# EAGLE design Esquema (EAGLE 8.7.0)
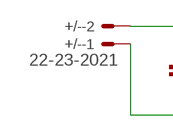
[diagram p0: schematic, sheet 1, part 1 of 2]
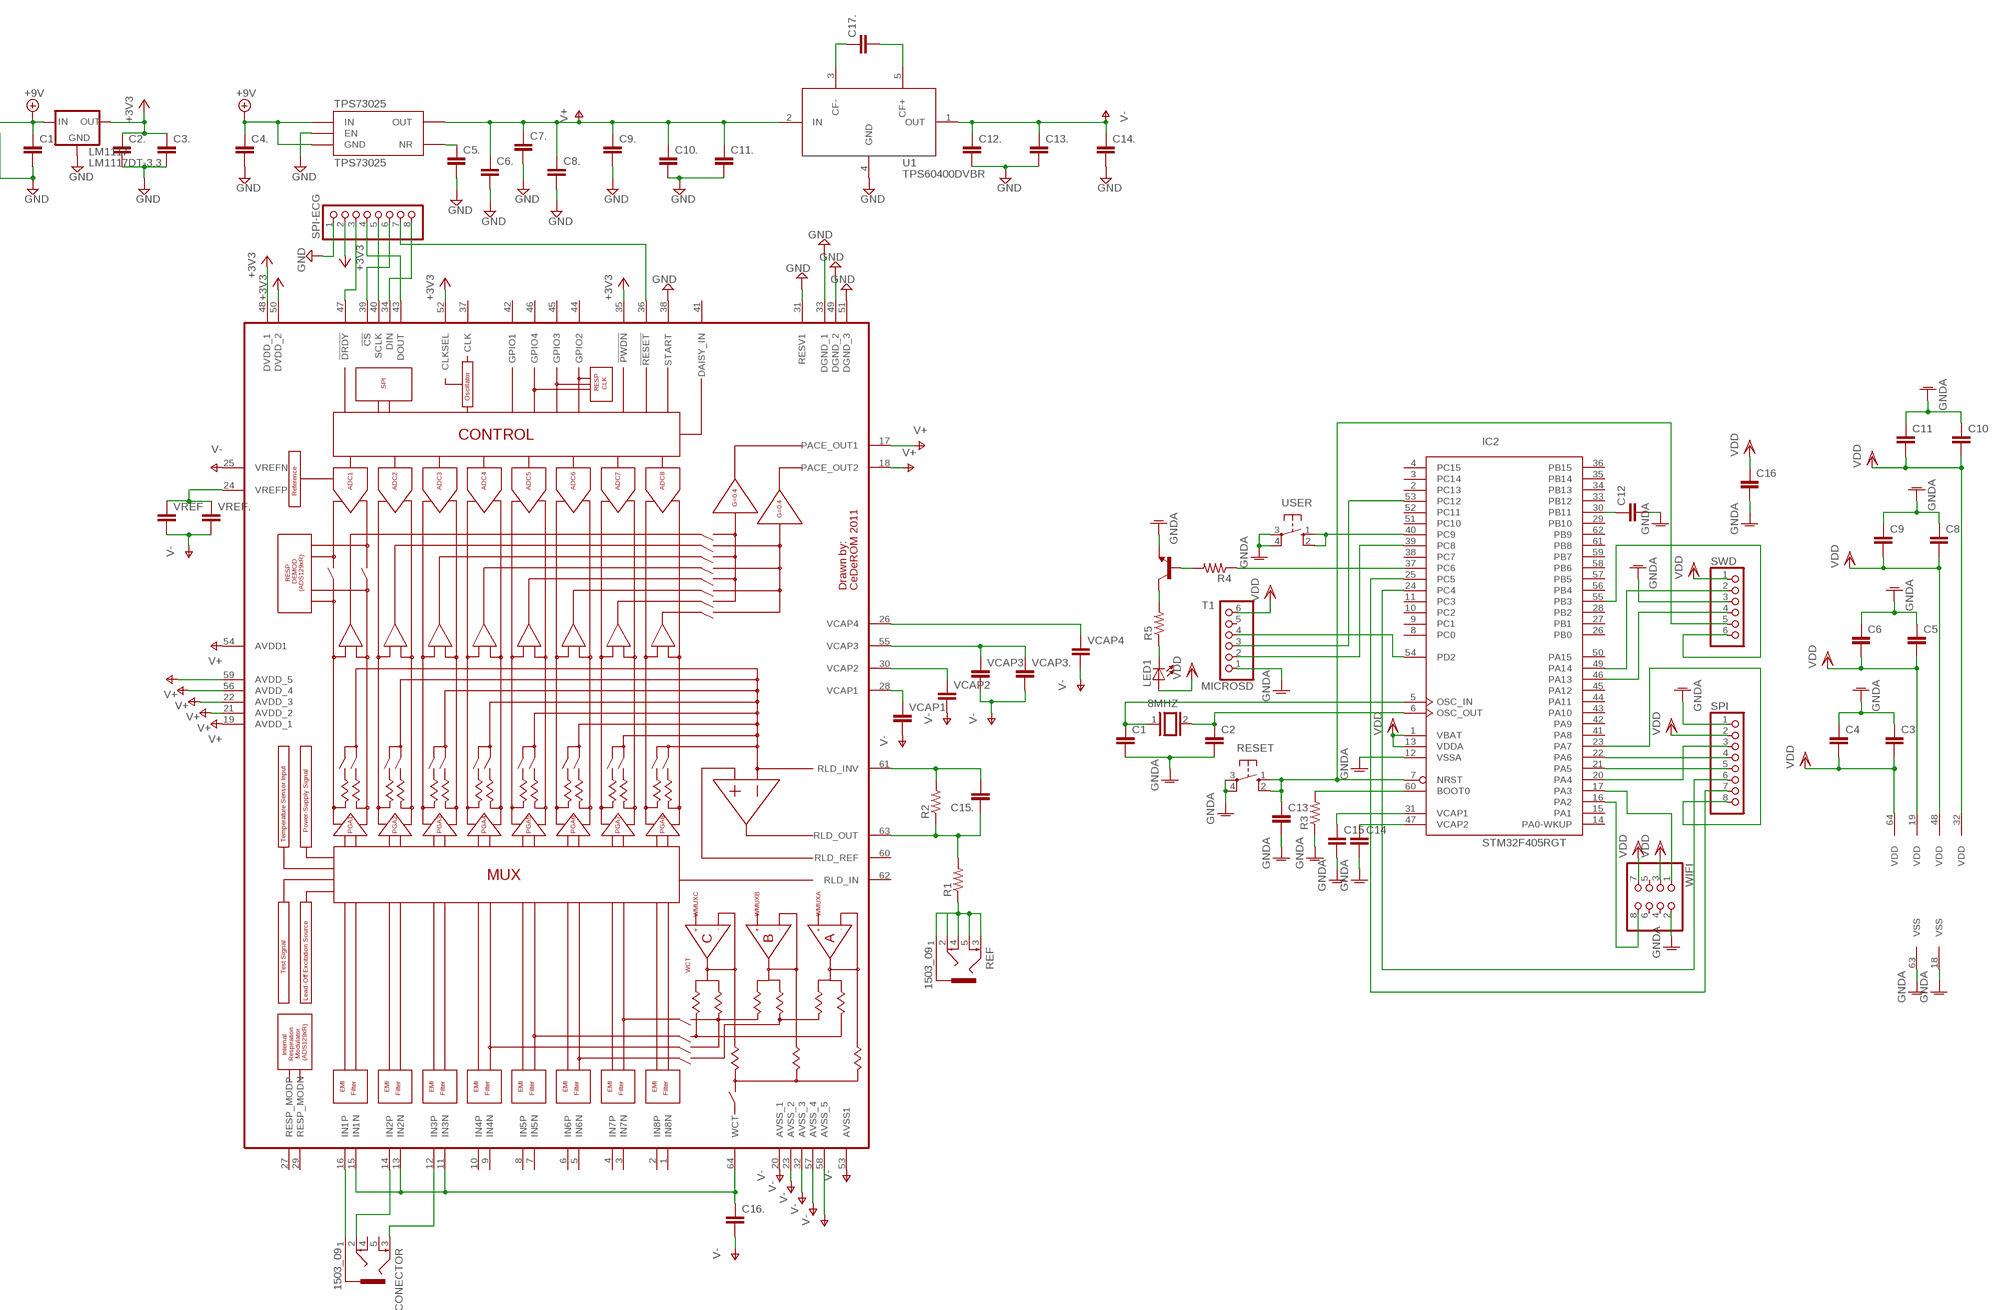
[diagram p1: schematic, sheet 1, part 2 of 2]

## Parts
8MHZ  XTAL/S  [QS]
+/-  22-23-2021  [22-23-2021]
C1  C-EUC0805K  [C0805K]
C1.  C-EUC1206K  [C1206K]
C2  C-EUC0805K  [C0805K]
C2.  C-EUC1206K  [C1206K]
C3  C-EUC1206K  [C1206K]
C3.  C-EUC1206K  [C1206K]
C4  C-EUC1206K  [C1206K]
C4.  C-EUC1206K  [C1206K]
C5  C-EUC1206K  [C1206K]
C5.  C-EUC0805K  [C0805K]
C6  C-EUC1206K  [C1206K]
C6.  C-EUC1206K  [C1206K]
C7.  C-EUC1206K  [C1206K]
C8  C-EUC1206K  [C1206K]
C8.  C-EUC1206K  [C1206K]
C9  C-EUC1206K  [C1206K]
C9.  C-EUC1206K  [C1206K]
C10  C-EUC1206K  [C1206K]
C10.  C-EUC1206K  [C1206K]
C11  C-EUC1206K  [C1206K]
C11.  C-EUC1206K  [C1206K]
C12  C-EUC1206K  [C1206K]
C12.  C-EUC1206K  [C1206K]
C13  C-EUC1206K  [C1206K]
C13.  C-EUC1206K  [C1206K]
C14  C-EUC1206K  [C1206K]
C14.  C-EUC1206K  [C1206K]
C15  C-EUC1206K  [C1206K]
C15.  C-EUC1206K  [C1206K]
C16  C-EUC1206K  [C1206K]
C16.  C-EUC0805K  [C0805K]
C17.  C-EUC1206K  [C1206K]
CONECTOR  1503_09  [1503_09]
IC2  STM32F405RGT  [LQFP64]
LED1  LEDCHIP-LED0805  [CHIP-LED0805]
LM1117  LM1117DT-3.3  [TO252]
MICROSD  PINHD-1X6  [1X06]
R1  R-US_R1206  [R1206]
R2  R-US_R1206  [R1206]
R3  R-US_R1206  [R1206]
R4  R-US_R1206  [R1206]
R5  R-US_R1206  [R1206]
REF  1503_09  [1503_09]
RESET  10-XX  [B3F-10XX]
SPI  PINHD-1X8  [1X08]
SPI-ECG  PINHD-1X8  [1X08]
SWD  PINHD-1X6  [1X06]
T1  MMBT2222ALT1-NPN-SOT23-BEC  [SOT23-BEC]
TPS73025  TPS73025  [SOT23-5L]
U1  TPS60400DVBR  [SOT23-5]
U$1  ADS1298*PAG*  [TQFP64]
USER  10-XX  [B3F-10XX]
VCAP1  C-EUC0805K  [C0805K]
VCAP2  C-EUC1206K  [C1206K]
VCAP3  C-EUC1206K  [C1206K]
VCAP3.  C-EUC1206K  [C1206K]
VCAP4  C-EUC1206K  [C1206K]
VREF  C-EUC1206K  [C1206K]
VREF.  C-EUC1206K  [C1206K]
WIFI  PINHD-2X4  [2X04]

## Nets
+3V3: C2..1 C3..1 LM1117.3(OUT) SPI-ECG.2 U$1.35(!PWDN) U$1.48(DVDD_1) U$1.50(DVDD_2) U$1.52(CLKSEL)
+9V: +/-.2 C1..1 C4..1 LM1117.2(IN) TPS73025.1(IN) TPS73025.2(GND)
GND: +/-.1 C1..2 C2..2 C3..2 C4..2 C5..2 C6..2 C7..2 C8..2 C9..2 C10..2 C11..2 C12..2 C13..2 C14..2 LM1117.1(GND) SPI-ECG.1 TPS73025.3(EN) U1.4(GND) U$1.31(RESV1) U$1.33(DGND_1) U$1.38(START) U$1.49(DGND_2) U$1.51(DGND_3)
GNDA: C1.2 C2.2 C3.1 C4.1 C5.1 C6.1 C8.1 C9.1 C10.1 C11.1 C12.2 C13.2 C14.2 C15.2 C16.2 IC2.12(VSSA) IC2.18(VSS) IC2.63(VSS) MICROSD.1 R3.1 RESET.3(P) RESET.4(P1) SPI.1 SWD.3 T1.E USER.3(P) USER.4(P1) WIFI.2
N$1: C17..1 U1.3(CF-)
N$2: U$1.24(VREFP) VREF.1 VREF..1
N$3: C14.1 IC2.47(VCAP2)
N$4: C17..2 U1.5(CF+)
N$5: U$1.28(VCAP1) VCAP1.1
N$6: C5..1 TPS73025.4(NR)
N$7: U$1.30(VCAP2) VCAP2.1
N$8: U$1.55(VCAP3) VCAP3.1 VCAP3..1
N$9: U$1.26(VCAP4) VCAP4.1
N$10: C16..1 U$1.11(IN3N) U$1.13(IN2N) U$1.15(IN1N) U$1.64(WCT)
N$11: SPI-ECG.7 U$1.36(!RESET)
N$12: SPI-ECG.4 U$1.43(DOUT)
N$13: SPI-ECG.5 U$1.40(SCLK)
N$14: SPI-ECG.6 U$1.39(!CS)
N$15: SPI-ECG.8 U$1.34(DIN)
N$16: SPI-ECG.3 U$1.47(!DRDY)
N$17: C15..1 R1.2 R2.1 U$1.63(RLD_OUT)
N$18: C15..2 R2.2 U$1.61(RLD_INV)
N$19: R1.1 REF.1 REF.2 REF.3 REF.4 REF.5
N$20: CONECTOR.1 U$1.16(IN1P)
N$21: CONECTOR.2 U$1.14(IN2P)
N$22: CONECTOR.3 U$1.12(IN3P)
N$23: 8MHZ.1 C1.1 IC2.5(OSC_IN)
N$24: 8MHZ.2 C2.1 IC2.6(OSC_OUT)
N$25: IC2.60(BOOT0) R3.2
N$26: C12.1 IC2.30(PB11)
N$27: C13.1 IC2.7(NRST) RESET.1(S) RESET.2(S1) SWD.5
N$28: IC2.40(PC9) USER.1(S) USER.2(S1)
N$29: IC2.22(PA6) SPI.4
N$30: IC2.21(PA5) SPI.5
N$31: IC2.24(PC4) SPI.6
N$32: IC2.25(PC5) SPI.7
N$33: IC2.23(PA7) SPI.8
N$34: IC2.20(PA4) SPI.3
N$35: IC2.49(PA14) SWD.2
N$36: IC2.46(PA13) SWD.4
N$37: IC2.55(PB3) SWD.6
N$38: IC2.39(PC8) MICROSD.2
N$39: IC2.53(PC12) MICROSD.3
N$40: IC2.54(PD2) MICROSD.4
N$41: C15.1 IC2.31(VCAP1)
N$42: IC2.16(PA2) WIFI.8
N$43: IC2.17(PA3) WIFI.1
N$44: R4.2 T1.B
N$45: IC2.37(PC6) R4.1
N$46: R5.2 T1.C
N$47: LED1.C R5.1
V+: C6..1 C7..1 C8..1 C9..1 C10..1 C11..1 TPS73025.5(OUT) U1.2(IN) U$1.17(PACE_OUT1) U$1.18(PACE_OUT2) U$1.19(AVDD_1) U$1.21(AVDD_2) U$1.22(AVDD_3) U$1.54(AVDD1) U$1.56(AVDD_4) U$1.59(AVDD_5)
V-: C12..1 C13..1 C14..1 C16..2 U1.1(OUT) U$1.20(AVSS_1) U$1.23(AVSS_2) U$1.25(VREFN) U$1.32(AVSS_3) U$1.53(AVSS1) U$1.57(AVSS_4) U$1.58(AVSS_5) VCAP1.2 VCAP2.2 VCAP3.2 VCAP3..2 VCAP4.2 VREF.2 VREF..2
VDD: C3.2 C4.2 C5.2 C6.2 C8.2 C9.2 C10.2 C11.2 C16.1 IC2.1(VBAT) IC2.13(VDDA) IC2.19(VDD) IC2.32(VDD) IC2.48(VDD) IC2.64(VDD) LED1.A MICROSD.6 SPI.2 SWD.1 WIFI.3 WIFI.7
Unconnected: CONECTOR.4 CONECTOR.5 IC2.2(PC13) IC2.3(PC14) IC2.4(PC15) IC2.8(PC0) IC2.9(PC1) IC2.10(PC2) IC2.11(PC3) IC2.14(PA0-WKUP) IC2.15(PA1) IC2.26(PB0) IC2.27(PB1) IC2.28(PB2) IC2.29(PB10) IC2.33(PB12) IC2.34(PB13) IC2.35(PB14) IC2.36(PB15) IC2.38(PC7) IC2.41(PA8) IC2.42(PA9) IC2.43(PA10) IC2.44(PA11) IC2.45(PA12) IC2.50(PA15) IC2.51(PC10) IC2.52(PC11) IC2.56(PB4) IC2.57(PB5) IC2.58(PB6) IC2.59(PB7) IC2.61(PB8) IC2.62(PB9) MICROSD.5 U$1.1(IN8N) U$1.2(IN8P) U$1.3(IN7N) U$1.4(IN7P) U$1.5(IN6N) U$1.6(IN6P) U$1.7(IN5N) U$1.8(IN5P) U$1.9(IN4N) U$1.10(IN4P) U$1.27(RESP_MODP) U$1.29(RESP_MODN) U$1.37(CLK) U$1.41(DAISY_IN) U$1.42(GPIO1) U$1.44(GPIO2) U$1.45(GPIO3) U$1.46(GPIO4) U$1.60(RLD_REF) U$1.62(RLD_IN) WIFI.4 WIFI.5 WIFI.6

## Library data of the parts
8MHZ = special:XTAL/S: CRYSTAL
+/- = con-molex:22-23-2021: .100" (2.54mm) Center Header - 2 Pin; MF: MOLEX; MPN: 22-23-2021; OC_FARNELL: 1462926; OC_NEWARK: 25C3832
C1-C6 C8-C15 C15. C16 C16. = resistor:C-EU: CAPACITOR, European symbol
C1. C2. C3. C4. C5. C6. C7. C8. C9. C10. C11. C12. C13. C14. C17. VCAP1-VCAP3 VCAP3. VCAP4 VREF VREF. = rcl:C-EU: CAPACITOR, European symbol; SPICEPREFIX: C
CONECTOR REF = con-lumberg:1503_09: Jack connectors according to JISC 6560, 3.5 mm Klinkeneinbaukupplung nach JISC 6560, 3,5 mm, 3-polig/ stereo, abgewinkelte Ausführung, mit 2 Öffnern und Lötaugen, für Leiterplatten Rückseitenmontage Source: http://www.lumberg.com/Produkte/PDFs/1503_09.pdf; OC_FARNELL: 1243244; OC_NEWARK: unknown
IC2 = micro-stm_v2:STM32F405R*T: ARM 32-bit Cortex™-M3 CPU 168 MHz maximum frequency 1024 Kbytes of Flash memory 192 kbytes of SRAM 51 GPIOs 1.8 to 3.6 V application supply
LED1 = led:LED: LED OSRAM: - CHIPLED LG R971, LG N971, LY N971, LG Q971, LY Q971, LO R971, LY R971 LH N974, LH R974 LS Q976, LO Q976, LY Q976 LO Q996 - Hyper CHIPLED LW Q18S LB Q993, LB Q99A, LB R99A - SideLED LS A670, LO A670, LY A670, LG A670, LP A670 LB A673, LV A673, LT A673, LW A673 LH A674 LY A675 LS A676, LA A676, LO A676, LY A676, LW A676 LS A679, LY A679, LG A679 - Hyper Micro SIDELED® LS Y876, LA Y876, LO Y876, LY Y876 LT Y87S - SmartLED LW L88C, LW L88S LB L89C, LB L89S, LG L890 LS L89K, LO L89K, LY L89K LS L896, LA L896, LO L896, LY L896 - TOPLED LS T670, LO T670, LY T670, LG T670, LP T670 LSG T670, LSP T670, LSY T670, LOP T670, LYG T670 LG T671, LOG T671, LSG T671 LB T673, LV T673, LT T673, LW T673 LH T674 LS T676, LA T676, LO T676, LY T676, LB T676, LH T676, LSB T676, LW T676 LB T67C, LV T67C, LT T67C, LS T67K, LO T67K, LY T67K, LW E67C LS E67B, LA E67B, LO E67B, LY E67B, LB E67C, LV E67C, LT E67C LW T67C LS T679, LY T679, LG T679 LS T770, LO T770, LY T770, LG T770, LP T770 LB T773, LV T773, LT T773, LW T773 LH T774 LS E675, LA E675, LY E675, LS T675 LS T776, LA T776, LO T776, LY T776, LB T776 LHGB T686 LT T68C, LB T68C - Hyper Mini TOPLED® LB M676 - Mini TOPLED Santana® LG M470 LS M47K, LO M47K, LY M47K Source: http://www.osram.convergy.de LUXEON: - LUMILED® LXK2-PW12-R00, LXK2-PW12-S00, LXK2-PW14-U00, LXK2-PW14-V00 LXK2-PM12-R00, LXK2-PM12-S00, LXK2-PM14-U00 LXK2-PE12-Q00, LXK2-PE12-R00, LXK2-PE12-S00, LXK2-PE14-T00, LXK2-PE14-U00 LXK2-PB12-K00, LXK2-PB12-L00, LXK2-PB12-M00, LXK2-PB14-N00, LXK2-PB14-P00, LXK2-PB14-Q00 LXK2-PR12-L00, LXK2-PR12-M00, LXK2-PR14-Q00, LXK2-PR14-R00 LXK2-PD12-Q00, LXK2-PD12-R00, LXK2-PD12-S00 LXK2-PH12-R00, LXK2-PH12-S00 LXK2-PL12-P00, LXK2-PL12-Q00, LXK2-PL12-R00 Source: www.luxeon.com KINGBRIGHT: KA-3528ASYC Source: www.kingbright.com
LM1117 = lm1117_10:LM1117?-*: 800mA Low-Dropout Linear Regulator Source: http://www.ti.com/lit/ds/symlink/lm1117-n.pdf; MF: Texas Instruments; MPN: LM1117DT-3.3; OC_FARNELL: 1469048; OC_NEWARK: 41K3430
MICROSD SWD = pinhead:PINHD-1X6: PIN HEADER
R1-R5 = resistor:R-US_: RESISTOR, American symbol
RESET USER = switch-omron:10-XX: OMRON SWITCH; MPN: B3F-1000; OC_FARNELL: 176432; OC_NEWARK: 36M3542
SPI SPI-ECG = pinhead:PINHD-1X8: PIN HEADER
T1 = transistor-neu-to92:*-NPN-: NPN Transistror
TPS73025 = texas-instruments:TPS73025
U1 = TPS6040x:TPS6040*: Texas Instruments TPS4060x • Inverts Input Supply Voltage • Up to 60-mA Output Current • Only Three Small 1-μF Ceramic Capacitors Needed • Input Voltage Range From 1.6 V to 5.5 V • PowerSave-Mode for Improved Efficiency at Low- Output Currents (TPS60400) • Device Quiescent Current Typical 65 μA • Integrated Active Schottky-Diode for Start-up Into Load • Small 5-Pin SOT-23 Package • Evaluation Module Available TPS60400EVM-178 Datasheet <http://www.ti.com/lit/ds/symlink/tps60400.pdf>; DIST: FARNELL; MOQ: 3000; SMD_MARKING: PFKI
U$1 = ADS1298:ADS1298: 8-Channel, 24-Bit Analog-To-Digital Converter With Integrated ECG Front End. Warning: PAG variant (TQFP package) does not have Respiration Module - pins 27 and 29 must stay unconnected! Drawn 23.07.2011 by Tomasz Boleslaw CEDRO (http://www.tomek.cedro.info).
WIFI = pinhead:PINHD-2X4: PIN HEADER

## Board
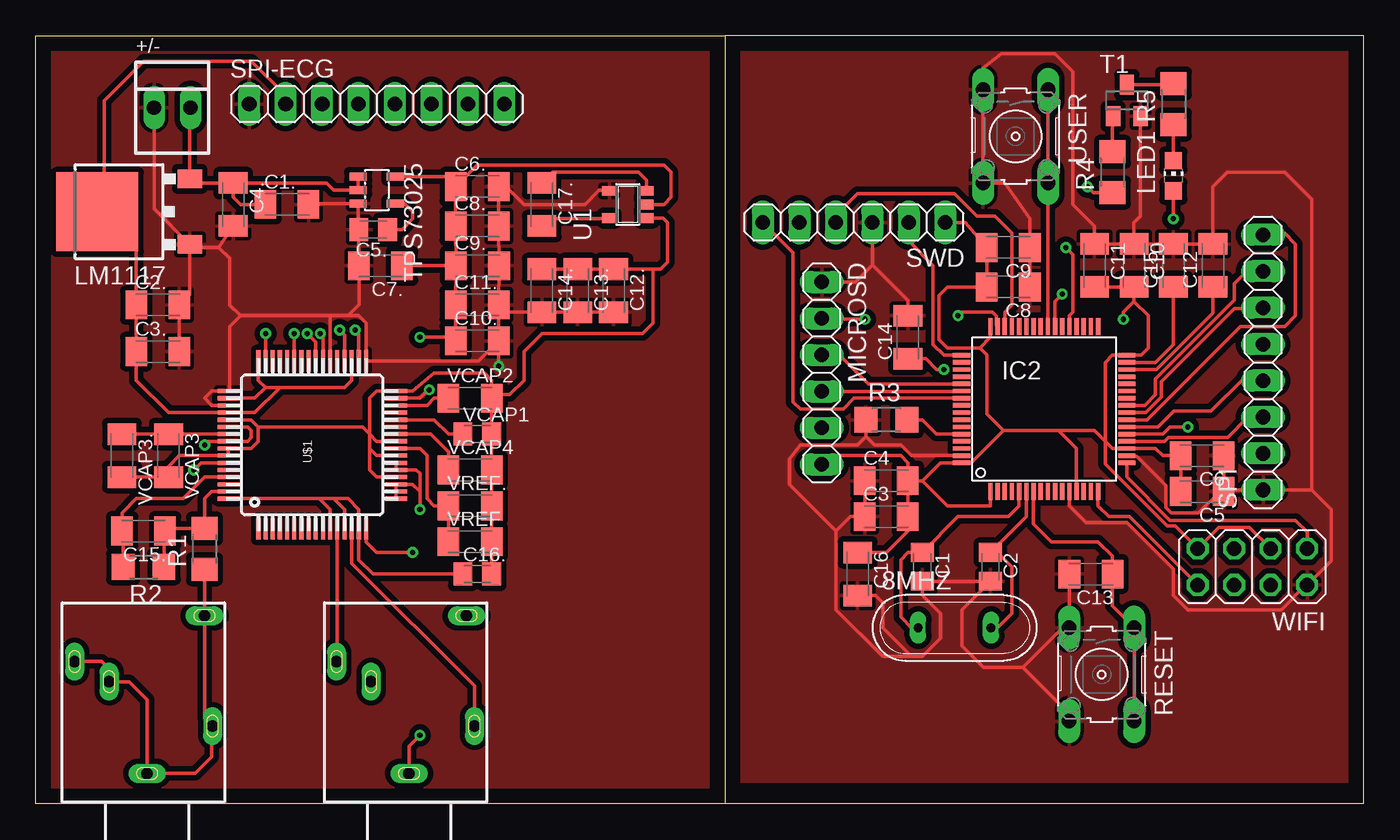
[diagram p2: board, top side]
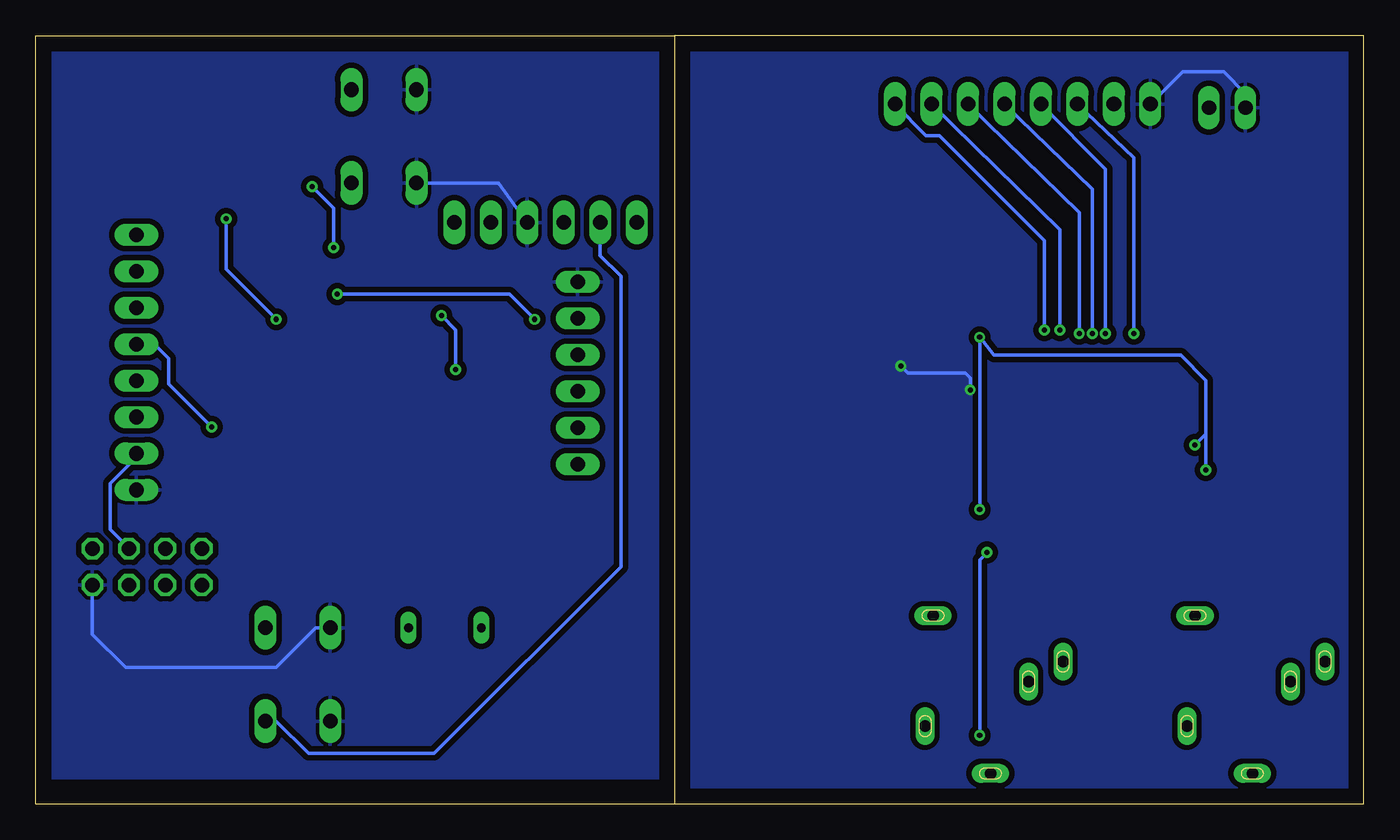
[diagram p3: board, bottom side, seen from below]

Size 92.5 x 53.5 mm. Coordinates in mm from the lower left corner, seen from the top.
Outline: 48,53.5 48,0
Outline: 48,53.5 92.5,53.5 92.5,0 48,0
Outline: 48,0 0,0 0,53.5 48,53.5
Copper layers (1*16): Top 0.035mm / dielectric 1.5mm / Bottom 0.035mm
Design rules "default *": minimum track width 6mil, minimum drill 0.35mm, track to track 6mil, track to pad 6mil, pad to pad 6mil, via to via 6mil, smd to smd 6mil, copper to edge 40mil, drill to drill 6mil, minimum pad ring 10mil, minimum via ring 8mil, stop-mask expansion 4mil, vias tented up to drill 0mil, thermal gap 10mil

### Footprints (pad centres in the part's own frame; a part is rotated, then mirrored left to right if it is on the bottom)
QS = drill 0.61 long: 1 -2.54,0; 2 2.54,0
22-23-2021 = drill 1 long: 1 -1.27,0; 2 1.27,0
C0805K = smd 1.3 x 1.6: 1 -1,0; 2 1,0
C1206K = smd 1.5 x 2: 1 -1.5,0; 2 1.5,0
1503_09 = drill 0.8 pad 1.2 long: 1 0,-2.1; 2 -4.55,-5.4; 3 5.05,-9.9; 4 -4,-13.1; 5 2.65,-8.5
LQFP64 = smd 0.3 x 1.2: 1 -3.75,-5.75; 2 -3.25,-5.75; 3 -2.75,-5.75; 4 -2.25,-5.75; 5 -1.75,-5.75; 6 -1.25,-5.75; 7 -0.75,-5.75; 8 -0.25,-5.75; 9 0.25,-5.75; 10 0.75,-5.75; 11 1.25,-5.75; 12 1.75,-5.75; 13 2.25,-5.75; 14 2.75,-5.75; 15 3.25,-5.75; 16 3.75,-5.75; 33 3.75,5.75; 34 3.25,5.75; 35 2.75,5.75; 36 2.25,5.75; 37 1.75,5.75; 38 1.25,5.75; 39 0.75,5.75; 40 0.25,5.75; 41 -0.25,5.75; 42 -0.75,5.75; 43 -1.25,5.75; 44 -1.75,5.75; 45 -2.25,5.75; 46 -2.75,5.75; 47 -3.25,5.75; 48 -3.75,5.75 | smd 1.2 x 0.3: 17 5.75,-3.75; 18 5.75,-3.25; 19 5.75,-2.75; 20 5.75,-2.25; 21 5.75,-1.75; 22 5.75,-1.25; 23 5.75,-0.75; 24 5.75,-0.25; 25 5.75,0.25; 26 5.75,0.75; 27 5.75,1.25; 28 5.75,1.75; 29 5.75,2.25; 30 5.75,2.75; 31 5.75,3.25; 32 5.75,3.75; 49 -5.75,3.75; 50 -5.75,3.25; 51 -5.75,2.75; 52 -5.75,2.25; 53 -5.75,1.75; 54 -5.75,1.25; 55 -5.75,0.75; 56 -5.75,0.25; 57 -5.75,-0.25; 58 -5.75,-0.75; 59 -5.75,-1.25; 60 -5.75,-1.75; 61 -5.75,-2.25; 62 -5.75,-2.75; 63 -5.75,-3.25; 64 -5.75,-3.75
CHIP-LED0805 = smd 1.2 x 1.2: A 0,-1.05; C 0,1.05
TO252 = smd 1.3 x 1.7: 1 -2.285,-4.22; 2 2.285,-4.22 | smd 5.5 x 5.7: 3 0,2.22
1X06 = drill 1.016 long: 1 -6.35,0; 2 -3.81,0; 3 -1.27,0; 4 1.27,0; 5 3.81,0; 6 6.35,0
R1206 = smd 1.6 x 1.803: 1 -1.422,0; 2 1.422,0
B3F-10XX = drill 1.016 long: 1 -3.251,2.261; 2 3.251,2.261; 3 -3.251,-2.261; 4 3.251,-2.261
1X08 = drill 1.016 long: 1 -8.89,0; 2 -6.35,0; 3 -3.81,0; 4 -1.27,0; 5 1.27,0; 6 3.81,0; 7 6.35,0; 8 8.89,0
SOT23-BEC = smd 1 x 1.4: B -0.95,-1.1; C 0,1.1; E 0.95,-1.1
SOT23-5L = smd 0.55 x 1.2: 1 -0.95,-1.3; 2 0,-1.3; 3 0.95,-1.3; 4 0.95,1.3; 5 -0.95,1.3
SOT23-5 = smd 0.69 x 0.99: 1 -0.95,-1.29; 2 0,-1.29; 3 0.95,-1.29; 4 0.95,1.3; 5 -0.95,1.3
TQFP64 = smd 1.5 x 0.285: 1 -5.85,3.75; 2 -5.85,3.25; 3 -5.85,2.75; 4 -5.85,2.25; 5 -5.85,1.75; 6 -5.85,1.25; 7 -5.85,0.75; 8 -5.85,0.25; 9 -5.85,-0.25; 10 -5.85,-0.75; 11 -5.85,-1.25; 12 -5.85,-1.75; 13 -5.85,-2.25; 14 -5.85,-2.75; 15 -5.85,-3.25; 16 -5.85,-3.75; 33 5.85,-3.75; 34 5.85,-3.25; 35 5.85,-2.75; 36 5.85,-2.25; 37 5.85,-1.75; 38 5.85,-1.25; 39 5.85,-0.75; 40 5.85,-0.25; 41 5.85,0.25; 42 5.85,0.75; 43 5.85,1.25; 44 5.85,1.75; 45 5.85,2.25; 46 5.85,2.75; 47 5.85,3.25; 48 5.85,3.75 | smd 0.285 x 1.5: 17 -3.75,-5.85; 18 -3.25,-5.85; 19 -2.75,-5.85; 20 -2.25,-5.85; 21 -1.75,-5.85; 22 -1.25,-5.85; 23 -0.75,-5.85; 24 -0.25,-5.85; 25 0.25,-5.85; 26 0.75,-5.85; 27 1.25,-5.85; 28 1.75,-5.85; 29 2.25,-5.85; 30 2.75,-5.85; 31 3.25,-5.85; 32 3.75,-5.85; 49 3.75,5.85; 50 3.25,5.85; 51 2.75,5.85; 52 2.25,5.85; 53 1.75,5.85; 54 1.25,5.85; 55 0.75,5.85; 56 0.25,5.85; 57 -0.25,5.85; 58 -0.75,5.85; 59 -1.25,5.85; 60 -1.75,5.85; 61 -2.25,5.85; 62 -2.75,5.85; 63 -3.25,5.85; 64 -3.75,5.85
2X04 = drill 1.016 octagon: 1 -3.81,-1.27; 2 -3.81,1.27; 3 -1.27,-1.27; 4 -1.27,1.27; 5 1.27,-1.27; 6 1.27,1.27; 7 3.81,-1.27; 8 3.81,1.27

### Placement (x,y rotation side)
8MHZ  64,12.25 0 top
+/-  9.5,48.5 0 top
C1  61.75,16.5 270 top
C1.  17.5,41.75 0 top
C2  66.5,16.5 270 top
C2.  8.5,34.75 0 top
C3  59.25,20 0 top
C3.  8.5,31.5 0 top
C4  59.25,22.5 0 top
C4.  13.75,41.75 270 top
C5  81.25,21.75 180 top
C5.  23.5,40 180 top
C6  81.25,24.25 180 top
C6.  30.75,43 0 top
C7.  24.01,37.48 180 top
C8  67.75,36 180 top
C8.  30.75,40.25 0 top
C9  67.75,38.75 180 top
C9.  30.77,37.48 0 top
C10  76.5,37.5 270 top
C10.  30.75,32.25 0 top
C11  73.75,37.5 270 top
C11.  30.75,34.75 0 top
C12  82,37.5 90 top
C12.  40.25,35.75 270 top
C13  73.5,16 180 top
C13.  37.75,35.75 270 top
C14  60.75,32.5 90 top
C14.  35.25,35.75 270 top
C15  79.25,37.5 90 top
C15.  7.5,19 180 top
C16  57.25,16 270 top
C16.  30.75,16 0 top
C17.  35.25,41.75 270 top
CONECTOR  26,0 180 top
IC2  70.25,27.5 0 top
LED1  79.25,43.75 0 top
LM1117  6.5,41.25 90 top
MICROSD  54.75,30 270 top
R1  11.75,17.75 90 top
R2  7.5,16.5 180 top
R3  59.25,26.75 0 top
R4  75,44 90 top
R5  79.25,48.75 90 top
REF  7.75,0 180 top
RESET  74.25,9 270 top
SPI  85.5,30.75 90 top
SPI-ECG  23.75,48.75 0 top
SWD  57,40.5 180 top
T1  76,49 0 top
TPS73025  23.75,42.75 270 top
U1  41.25,41.75 90 top
U$1  19.25,25 90 top
USER  68.25,46.5 270 top
VCAP1  30.75,25.75 0 top
VCAP2  30.25,28.25 0 top
VCAP3  9.25,24.25 270 top
VCAP3.  6,24.25 270 top
VCAP4  30.25,23.25 0 top
VREF  30.25,18.25 0 top
VREF.  30.25,20.75 0 top
WIFI  84.75,16.5 180 top

### Tracks (layer width: path | path; a pad name or v marks a point on that pad's centre or on a via)
+3V3
  Top 0.152: LM1117.3 4.51,41.02 7,38.53
  Top 0.254: 7,38.53 C2..1 C3..1 7,29.5 9.25,27.25 U$1.52 15.25,27.25 17,29 | U$1.35 22,29.5 21.5,29 17,29 | 17,29 16,29 | 16,29 15.5,29.5 U$1.48 | U$1.50 15.25,28.25 16,29 | SPI-ECG.2 17.4,49.35 15,51.75 7.5,51.75 4.75,49 4.75,41.25 4.51,41.02
+9V
  Top 0.254: C4..1 20.25,43.25 20.75,42.75 TPS73025.2 TPS73025.1 | C4..1 11.01,43.25 LM1117.2 10.72,48.45 +/-.2 | C4..1 13.75,42.25 14.25,41.75 C1..1
GND  (via drill 0.35)
  Top 0.152: 22.45,39.8 C5..2 | C11..2 32.25,34.5 32.5,34.25
  Top 0.254: C4..2 12.75,38.75 | 12.75,38.75 10.94,38.75 LM1117.1 | +/-.1 8.23,41.45 LM1117.1 | U$1.51 12.25,27.75 11.75,28.25 12.25,28.75 U$1.49 13.5,28.85 13.5,33.25 14.25,34 | TPS73025.3 22.5,41.75 | C12..2 C13..2 C14..2 32.75,34.25 C11..2 | C11..2 C10..2 | C11..2 C9..2 C8..2 C6..2 32.75,43 34,41.75 38.25,41.75 39.25,42.75 39.9,42.75 U1.4 | TPS73025.3 22.45,40.05 C5..2 C7..2 22.51,34.76 21.75,34 | C10..2 30.85,30.85 U$1.33 23,33.5 22.5,34 22,34 | 20.5,34 20.47,33.97 | U$1.38 20.5,34 | 20.5,34 21.75,34 | 21.75,34 22,34 | 22.01,34.01 22,34 | 20.5,34 14.25,34 | TPS73025.3 19.05,41.8 C1..2 | 12.75,38.75 13.5,38 13.5,34.75 14.25,34 | U$1.31 26.75,28.25 27.34,28.84 v27.41,28.84 | v32.25,30.5 C10..2 | C3..2 C2..2 10.72,35.47 LM1117.1
  Bottom 0.254: SPI-ECG.1 12.61,51 9.75,51 8.23,49.48 +/-.1 | v27.41,28.84 27.41,29.66 27.75,30 31.75,30 v32.25,30.5
  pour Top (isolate 0.381): 0.25,53.25 47.75,53.25 47.75,0.25 0.25,0.25
  pour Bottom (isolate 0.381): 0.5,53 47.25,53 47.5,0.5 0.5,0.5
GNDA
  Top 0.254: C4.1 C3.1 56.75,20 55.75,19 | C5.1 C6.1 | C8.1 C9.1 69.25,40.75 67.5,43.25 USER.4 | C10.1 C11.1 73.75,40.25 72.25,41.75 72.25,51 71,52.25 67.25,52.25 65.99,51.24 USER.3 USER.4 | 88.89,21.86 SPI.1 82.86,21.86 C5.1 | 88.89,21.86 90.25,20.5 90.25,16.92 WIFI.2 88.48,15.23 86.75,13.5 80.25,13.5 79.25,14.5 79.25,16.34 76,19.59 73.16,19.59 72,20.75 IC2.12 | MICROSD.1 57.1,36.35 58.27,37.52 | 58.27,37.52 SWD.3 | USER.4 | 68.75,9.5 66,9.5 64.5,11 64.5,13.5 C2.2 C1.2 61.75,14.5 63,13.25 63,11.5 61.75,10.25 61,10.25 | 68.75,9.5 71.5,12.25 RESET.3 72,12.26 C13.2 | 61,10.25 59,10.25 55.75,13.5 55.75,19 | RESET.4 71.99,6.26 68.75,9.5 | 88.89,21.86 88.89,42.11 87,44 83,44 82,43 C12.2 C15.2 C10.1 | IC2.18 76.07,24.18 76.72,24.18 78.72,22.17 78.72,20.63 79.11,20.25 81,20.25 82.5,21.75 C5.1 | 55.75,19 52.5,22.25 52.5,24 53.25,25 57.25,25 57.83,25.58 | IC2.63 61,24.25 60.25,25 58.41,25 57.83,25.58 | 58.27,37.52 60.75,35.04 C14.2 | T1.E 76.95,40.95 76.5,40.5 C10.1 | 61,10.25 59,12.25 59,14 58.5,14.5 C16.2 | R3.1 57.83,25.58
  Bottom 0.254: USER.4 60.27,43.25 SWD.3 | RESET.3 73,12.25 75.75,9.5 86.25,9.5 88.56,11.81 WIFI.2
  pour Top (isolate 0.381): 48.25,53.25 92.25,53.25 92.25,1.5 48.25,1.5 48.25,4.25
  pour Bottom (isolate 0.381): 48.5,53 92,53 92,52.75 92,1.75 91.5,1.75 48.5,1.75 48.5,4.75
N$1
  Top 0.254: U1.3 42.54,43.46 42,44 36,44 C17..1
N$2
  Top 0.254: VREF.1 VREF..1 27.75,20.75 27.25,21.25 27.25,24.25 26.75,24.75 U$1.24
N$3  (via drill 0.35)
  Top 0.254: IC2.47 66.93,33.32 66.93,33.97 66.64,34.25 64.5,34.25 v64.25,34 | v63.25,30.25 62.75,30.25 62,31 C14.1
  Bottom 0.254: v64.25,34 63.25,33 v63.25,30.25
N$4
  Top 0.254: U1.5 39.9,40.75 35.75,40.75 C17..2
N$5
  Top 0.254: VCAP1.1 28.75,25.75 27.75,26.75 U$1.28
N$6
  Top 0.254: C5..1 25.5,40 26.25,40.75 26.25,41.25 25.7,41.8 TPS73025.4
N$7
  Top 0.254: VCAP2.1 27.75,28.25 27.25,27.75 U$1.30
N$8
  Top 0.254: U$1.55 VCAP3.1 VCAP3..1
N$9
  Top 0.254: VCAP4.1 28.75,24.5 27.5,25.75 U$1.26
N$10
  Top 0.254: C16..1 23.5,16 22.5,17 U$1.15 22.5,20.5 21.75,21.25 20.75,21.25 | U$1.64 19.75,21.25 | 19.75,21.25 20.75,21.25 | 19.75,21.25 20.5,20.5 U$1.11 | 20.75,21.25 21.5,20.5 U$1.13
N$11  (via drill 0.35)
  Top 0.254: v21.16,33 21.5,32.66 U$1.36
  Bottom 0.254: v21.16,33 21.16,40 SPI-ECG.7
N$12  (via drill 0.35)
  Top 0.254: U$1.43 v18,32.75
  Bottom 0.254: SPI-ECG.4 18,44.21 v18,32.75
N$13  (via drill 0.35)
  Top 0.152: U$1.40 19.5,32.16 19.45,32.2
  Top 0.254: v18.91,32.75 19.16,32.5 19.16,32.48 19.49,32.15 U$1.40
  Bottom 0.254: v18.91,32.75 18.91,42.83 SPI-ECG.5
N$14  (via drill 0.35)
  Top 0.254: U$1.39 20,32.5 19.82,32.68 v19.82,32.75
  Bottom 0.254: v19.82,32.75 19.82,41.2 SPI-ECG.6
N$15  (via drill 0.35)
  Top 0.254: U$1.34 22.5,32.75 v22.25,33
  Bottom 0.254: v22.25,33 22.25,39.25 29.55,46.55 30.5,46.55 SPI-ECG.8
N$16  (via drill 0.35)
  Top 0.254: U$1.47 v16,32.75
  Bottom 0.254: v16,32.75 16,45 SPI-ECG.3
N$17
  Top 0.152: 8.92,18.92 C15..1 9.17,19.17
  Top 0.254: R2.1 8.92,18.92 | 9.17,19.17 R1.2 11.75,21.25 12.25,21.75 U$1.63
N$18
  Top 0.152: 6.08,18.92 C15..2
  Top 0.254: R2.2 6.08,18.92 | U$1.61 11.75,22.75 10.25,21.25 7,21.25 6,20.25 C15..2
N$19
  Top 0.254: R1.1 REF.4 11.75,5.95 REF.2 12.25,5.35 12.25,3.25 11.1,2.1 REF.1 7.75,7.25 6.5,8.5 REF.5 5.1,9.4 4.6,9.9 REF.3
N$20  (via drill 0.35)
  Top 0.254: CONECTOR.1 26,4 v26.75,4.75 | v26.25,17.5 23.75,17.5 23,18.25 U$1.16
  Bottom 0.254: v26.75,4.75 26.75,17 v26.25,17.5
N$21
  Top 0.254: U$1.14 22,16.75 30.55,8.2 CONECTOR.2
N$22
  Top 0.254: U$1.12 21,9.95 CONECTOR.3
N$23
  Top 0.254: IC2.5 68.5,20.75 67.75,20 64.25,20 C1.1 60.75,17.5 60.25,17 60.25,13 61,12.25 8MHZ.1
N$24
  Top 0.254: IC2.6 69,20 C2.1 67,17.5 68,16.5 68,13.25 67,12.25 8MHZ.2
N$25
  Top 0.254: R3.2 61.75,26.75 62.75,25.75 IC2.60
N$26
  Top 0.254: IC2.30 78.08,30.25 82,34.17 C12.1
N$27
  Top 0.254: 76.5,12.26 RESET.1 | RESET.1 RESET.2 | RESET.1 75,13.76 C13.1 75,17.25 74,18.25 70.75,18.25 69.5,19.5 IC2.7
  Bottom 0.254: RESET.2 75.75,5.75 73.5,3.5 64.75,3.5 51.75,16.5 51.75,36.75 53.19,38.19 SWD.5
N$28
  Top 0.254: USER.1 USER.2 70.51,33.26 IC2.40 70.53,33.28
N$29
  Top 0.254: IC2.22 78.17,26.25 79.27,27.35 81.85,27.35 84,29.5 85.48,29.5 SPI.4
N$30  (via drill 0.35)
  Top 0.254: IC2.21 78.5,25.75 79,26.25 v80.25,26.25
  Bottom 0.254: v80.25,26.25 83.25,29.25 83.25,31 84.27,32.02 SPI.5
N$31
  Top 0.254: SPI.6 85.44,34.5 83.5,34.5 78.41,29.41 78.41,28.33 77.33,27.25 IC2.24
N$32
  Top 0.254: IC2.25 77.25,27.75 78,28.5 78,29.6 83.5,35.1 83.5,36.25 84.35,37.1 SPI.7
N$33
  Top 0.254: SPI.8 86.89,39.64 87,39.75 87.75,39 87.75,34 87,33.25 83.9,33.25 77.4,26.75 IC2.23
N$34
  Top 0.254: IC2.20 78.61,25.25 78.88,25.53 83.03,25.53 84.44,26.94 SPI.3
N$35
  Top 0.254: IC2.49 63.25,31.25 62.5,32 62.5,37.5 60.81,39.19 SWD.2
N$36
  Top 0.254: IC2.46 67.5,34.25 68,34.75 68,39.75 66.81,40.94 65.56,40.94 64,42.5 57.25,42.5 55.73,40.98 SWD.4
N$37
  Top 0.254: SWD.6 52.75,38.4 52.75,28 53.25,27.5 56.25,27.5 57,28.25 IC2.55
N$38  (via drill 0.35)
  Top 0.254: IC2.39 71,35 v71.5,35.5 | v57.75,33.75 54.81,33.75 MICROSD.2
  Bottom 0.254: v71.5,35.5 59.5,35.5 v57.75,33.75
N$39
  Top 0.254: MICROSD.3 55.98,31.27 58,29.25 IC2.53
N$40
  Top 0.254: MICROSD.4 64.48,28.73 IC2.54
N$41
  Top 0.254: IC2.31 78,30.75 79.25,32 C15.1
N$42
  Top 0.254: WIFI.8 76.17,20 74.75,20 74,20.75 IC2.16
N$43
  Top 0.254: WIFI.1 88.56,18.94 87.75,19.75 79,19.75 76,22.75 IC2.17
N$44
  Top 0.254: R4.2 75,47.85 T1.B
N$45  (via drill 0.35)
  Top 0.254: R4.1 73.67,42.58 v73.25,43 | v71.75,38.75 72.25,38.25 72.25,34.25 72,34 IC2.37
  Bottom 0.254: v73.25,43 71.75,41.5 v71.75,38.75
N$46
  Top 0.254: T1.C 79.18,50.1 R5.2
N$47
  Top 0.254: R5.1 LED1.C
V+  (via drill 0.35)
  Top 0.254: U$1.22 U$1.21 26.5,23.25 26.75,23 26.75,21.75 | TPS73025.5 28.55,43.7 C6..1 | U1.2 43.75,41.75 44.25,42.25 44.25,44 43.75,44.5 30.75,44.5 C6..1 | C9..1 C11..1 C10..1 29,32.5 v26.75,32.5 | C9..1 C8..1 C6..1 | C7..1 C9..1 | U$1.54 14.75,26.25 15,26 15,25.5 14.75,25.25 U$1.56 12,25.25 v11.75,25 | 26.75,21.75 v26.75,20.5 | 26.75,21.75 26.25,22.25 U$1.19 U$1.18 U$1.17 | U$1.59 11.5,23.75 v11,23.25
  Bottom 0.254: v26.75,20.5 v26.75,32.5 25.75,31.25 12.75,31.25 11,29.5 11,25.75 | v11,23.25 11,25.75 | v11.75,25 11,25.75
V-
  Top 0.254: VCAP3..2 VCAP3.2 9.25,23.5 10,24.25 U$1.58 U$1.57 15,24.75 15.5,25.25 15.5,26.25 | U1.1 43.7,40.8 44,40.5 44,37.75 43.5,37.25 43,37.25 | 43,37.25 C12..1 C13..1 C14..1 | 43,37.25 43,33.5 42.25,32.75 35.25,32.75 34,31.5 34,29.5 33,28.5 32,28.5 VCAP2.2 | 31.75,28.75 VCAP2.2 | VCAP2.2 VCAP1.2 VCAP4.2 VREF..2 VREF.2 C16..2 | U$1.53 15,26.75 15.5,26.25 | VCAP2.2 31.75,29.5 31.25,30 27.75,30 26.25,28.75 U$1.32 23.75,28.75 23.25,28.25 23.25,25.75 | 23.25,25.75 23.75,25.25 U$1.25 | 23.25,25.75 23.25,24.75 | 23.25,24.75 23.75,24.25 U$1.23 | 23.25,24.75 23.25,23.25 23.75,22.75 U$1.20 | 15.5,26.25 22.75,26.25 23.25,25.75
VDD  (via drill 0.35)
  Top 0.254: C11.2 C10.2 76.5,35 | C5.2 C6.2 78.5,24.25 78,24.75 IC2.19 75,24.75 74.5,25.25 | C4.2 C3.2 60.75,19 59.25,17.5 C16.1 | SWD.1 64.75,40.5 C9.2 C8.2 63.5,36 62.91,35.41 62.91,32.34 63.5,31.75 65.75,31.75 | 74.5,25.25 74.5,30.75 75,31.25 IC2.32 77,31.25 77.5,31.75 77.5,34 76.5,35 | 74.5,25.25 73.75,26 71.25,26 | 74.5,25.25 74.5,23.67 78.83,19.34 79.37,19.34 WIFI.7 82.42,19.25 84.54,19.25 WIFI.3 | 71.25,26 67.39,26 | 67.39,26 65.14,23.75 IC2.64 63,23.75 61.75,22.5 | C4.2 61.75,22.5 | MICROSD.6 55.35,24.25 60.25,24.25 60.75,23.75 C4.2 | IC2.13 72.5,24.75 71.25,26 | IC2.1 66.5,20.75 63.5,20.75 61.75,22.5 | 65.75,31.75 66.25,31.25 66.25,27.15 67.39,26 | 65.75,31.75 66.5,32.5 IC2.48 | 76.5,35 75.75,34.25 v75.75,33.75 | v79.25,40.75 LED1.A
  Bottom 0.152: 85.64,23.99 85.64,24.3 SPI.2 | 86.1,17.9 WIFI.3
  Bottom 0.254: 85.64,23.99 87.32,22.32 87.32,19.12 86.1,17.9 | v75.75,33.75 79.25,37.25 v79.25,40.75